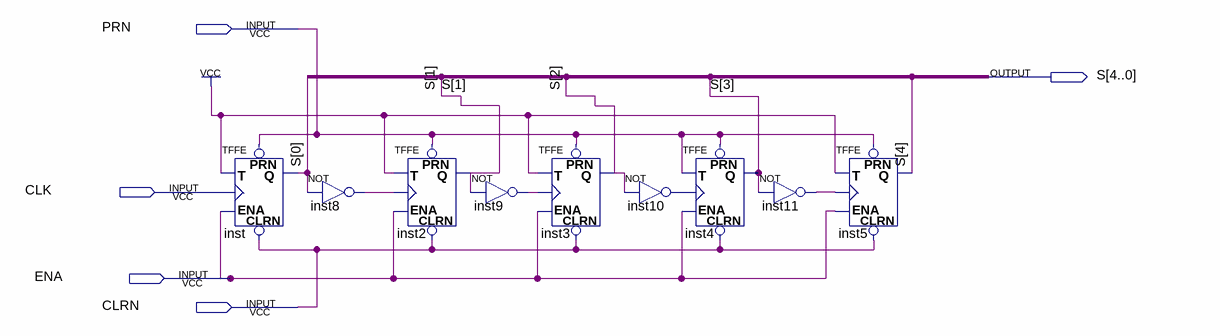
[diagram p0: schematic sheet]
// Quartus schematic PC.bdf as structural Verilog: 9 symbols, 5 pins
module PC (
  input  PRN,
  input  CLK,
  input  ENA,
  input  CLRN,
  output [4:0] S
);

  wire inst8_out, inst9_out, inst10_out, inst11_out;

  TFFE inst (.CLRN(CLRN), .T(1'b1), .CLK(CLK), .ENA(ENA), .PRN(PRN), .Q(S[0]));
  not inst8 (inst8_out, S[0]);
  TFFE inst2 (.CLRN(CLRN), .T(1'b1), .CLK(inst8_out), .ENA(ENA), .PRN(PRN), .Q(S[1]));
  not inst9 (inst9_out, S[1]);
  TFFE inst3 (.CLRN(CLRN), .T(1'b1), .CLK(inst9_out), .ENA(ENA), .PRN(PRN), .Q(S[2]));
  not inst10 (inst10_out, S[2]);
  TFFE inst4 (.CLRN(CLRN), .T(PRN), .CLK(inst10_out), .ENA(ENA), .PRN(PRN), .Q(S[3]));
  not inst11 (inst11_out, S[3]);
  TFFE inst5 (.CLRN(CLRN), .T(1'b1), .CLK(inst11_out), .ENA(ENA), .PRN(PRN), .Q(S[4]));
endmodule
